# Altium schematic sheet NVMe_(Storage)_Ports.schdoc
size 148 x 135 mm
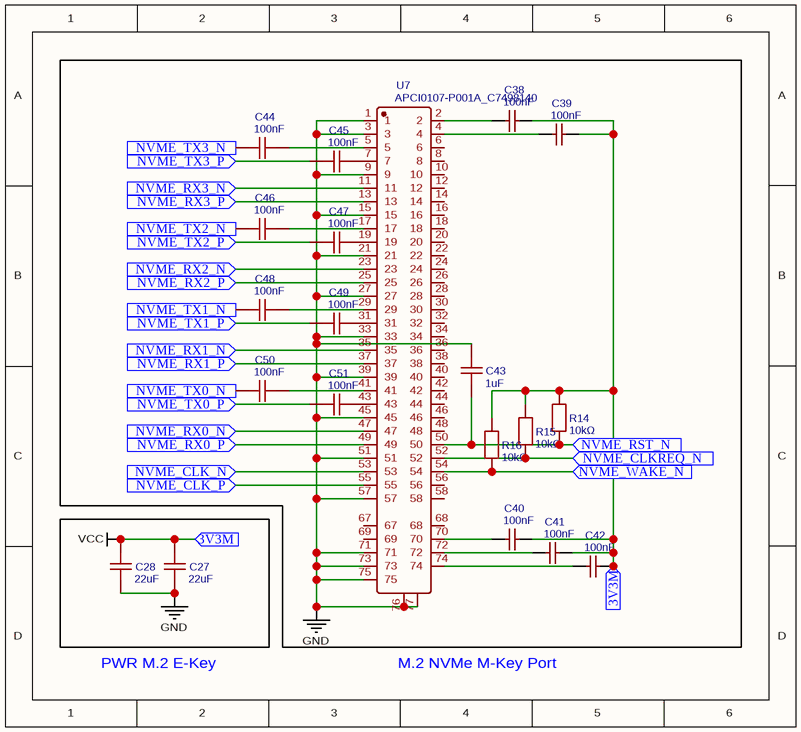
[diagram p0: NVMe_(Storage)_Ports.schdoc]

## Parts
C27  22uF  [C0805]
C28  22uF  [C0805]
C38  100nF  [C0402]
C39  100nF  [C0402]
C40  100nF  [C0402]
C41  100nF  [C0402]
C42  100nF  [C0402]
C43  1uF  [C0402]
C44  100nF  [C0402]
C45  100nF  [C0402]
C46  100nF  [C0402]
C47  100nF  [C0402]
C48  100nF  [C0402]
C49  100nF  [C0402]
C50  100nF  [C0402]
C51  100nF  [C0402]
R14  10kΩ  [R0402]
R15  10kΩ  [R0402]
R16  10kΩ  [R0402]
U7  APCI0107-P001A_C7498140  [CONN-SMD_APCI0107-P001A]

## Ports
3V3M (in), NVME_CLK_N (in), NVME_CLK_P (in), NVME_CLKREQ_N (in), NVME_RST_N (in), NVME_RX0_N (in), NVME_RX0_P (in), NVME_RX1_N (in), NVME_RX1_P (in), NVME_RX2_N (in), NVME_RX2_P (in), NVME_RX3_N (in), NVME_RX3_P (in), NVME_TX0_N (in), NVME_TX0_P (in), NVME_TX1_N (in), NVME_TX1_P (in), NVME_TX2_N (in), NVME_TX2_P (in), NVME_TX3_N (in), NVME_TX3_P (in), NVME_WAKE_N (in)

## Nets
GND: C27.1 C28.1 C43.2 U7.1 U7.3 U7.9 U7.15 U7.21 U7.27 U7.33 U7.39 U7.45 U7.51 U7.57 U7.71 U7.73 U7.75 U7.76 U7.77
VCC: C27.2 C28.2 C38.2 C39.2 C40.2 C41.2 C42.2 R14.2 R15.2 R16.2 ; port 3V3M
NVME_CLK_N: U7.53 ; port NVME_CLK_N
NVME_CLK_P: U7.55 ; port NVME_CLK_P
NVME_CLKREQ_N: R15.1 U7.52 ; port NVME_CLKREQ_N
NVME_RST_N: C43.1 R14.1 U7.50 ; port NVME_RST_N
NVME_RX0_N: U7.47 ; port NVME_RX0_N
NVME_RX0_P: U7.49 ; port NVME_RX0_P
NVME_RX1_N: U7.35 ; port NVME_RX1_N
NVME_RX1_P: U7.37 ; port NVME_RX1_P
NVME_RX2_N: U7.23 ; port NVME_RX2_N
NVME_RX2_P: U7.25 ; port NVME_RX2_P
NVME_RX3_N: U7.11 ; port NVME_RX3_N
NVME_RX3_P: U7.13 ; port NVME_RX3_P
NVME_TX0_N: C50.1 ; port NVME_TX0_N
NVME_TX0_P: C51.1 ; port NVME_TX0_P
NVME_TX1_N: C48.1 ; port NVME_TX1_N
NVME_TX1_P: C49.1 ; port NVME_TX1_P
NVME_TX2_N: C46.1 ; port NVME_TX2_N
NVME_TX2_P: C47.1 ; port NVME_TX2_P
NVME_TX3_N: C44.1 ; port NVME_TX3_N
NVME_TX3_P: C45.1 ; port NVME_TX3_P
NVME_WAKE_N: R16.1 U7.54 ; port NVME_WAKE_N
NetC38_1: C38.1 U7.2
NetC39_1: C39.1 U7.4
NetC40_1: C40.1 U7.70
NetC41_1: C41.1 U7.72
NetC42_1: C42.1 U7.74
NetC44_2: C44.2 U7.5
NetC45_2: C45.2 U7.7
NetC46_2: C46.2 U7.17
NetC47_2: C47.2 U7.19
NetC48_2: C48.2 U7.29
NetC49_2: C49.2 U7.31
NetC50_2: C50.2 U7.41
NetC51_2: C51.2 U7.43

Not connected (* = marked no-connect by the designer): U7 6 8 10 12 14 16 18 20 22 24 26 28 30 32 34 36 38 40 42 44 46 48 56 58 67 68 69

## Notes on the sheet
- PWR M.2 E-Key
- M.2 NVMe M-Key Port

## Library data of the parts
C27 C28 = 22uF: Manufacturer: SAMSUNG(三星); Manufacturer Part: CL21A226MAYNNNE; nameAlias: Value; Contributor: LCSC; Supplier: LCSC; Supplier Part: C602037; JLCPCB Part Class: Extended Part; spicePre: C; spiceSymbolName: CL21A226MAYNNNE
C38-C42 = 100nF: Manufacturer: YAGEO(国巨); Manufacturer Part: CC0402KRX5R8BB104; nameAlias: Value; Supplier: LCSC; Supplier Part: C106256; JLCPCB Part Class: Extended Part; spicePre: C; spiceSymbolName: CC0402KRX5R8BB104
C43 = 1uF: Manufacturer: Chinocera(华瓷); Manufacturer Part: HGC0402R5105K500NTEJ; nameAlias: Value; Contributor: lcsc; Supplier: LCSC; Supplier Part: C7472948; JLCPCB Part Class: Extended Part; spicePre: C; spiceSymbolName: HGC0402R5105K500NTEJ
C44-C51 = 100nF: Manufacturer: muRata(村田); Manufacturer Part: GRM155R71H104KE14J; Contributor: lcsc; nameAlias: Value; Supplier: LCSC; Supplier Part: C2649519; JLCPCB Part Class: Extended Part; spicePre: C; spiceSymbolName: GRM155R71H104KE14J
  C48-C51: link: https://lcsc.com/eda_search?q=C2649519&%26type=1&ref=editor
R14-R16 = 10kΩ: Manufacturer: FOJAN(富捷); Manufacturer Part: FRC0402F1002TS; nameAlias: Value; Contributor: LCSC; Supplier: LCSC; Supplier Part: C2906861; JLCPCB Part Class: Extended Part; spicePre: R; spiceSymbolName: FRC0402F1002TS
U7 = APCI0107-P001A_C7498140: Manufacturer: LX(连欣科技); Contributor: lcsc; Supplier: LCSC; Supplier Part: C7498140; Manufacturer Part: APCI0107-P001A; JLCPCB Part Class: Extended Part; spicePre: U; spiceSymbolName: APCI0107-P001A_C7498140